# Altium schematic sheet Main.SchDoc: OS-Solar
size A3; CompanyName: Kaasa5; DrawnBy: Nathan Kuchel; Organization: Kaasa5; Address1: 1 Chardonnay Blvd; Address2: Reynella, SA, 5161; Revision: 1.0.0; SheetNumber: 2; SheetTotal: 4; SheetTitle: Main
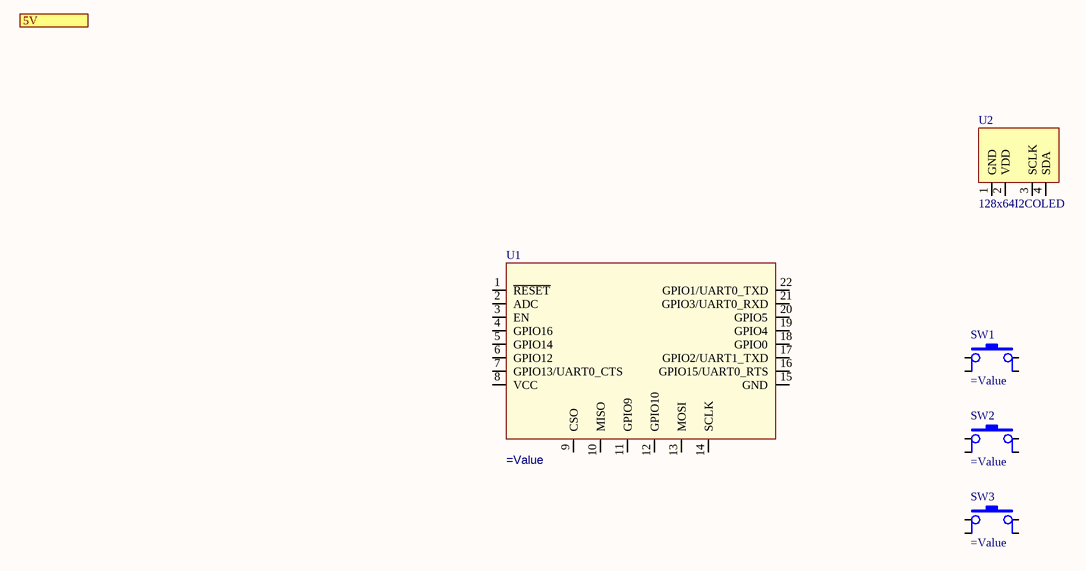
[diagram p0: Main.SchDoc]

## Parts
SW1  (no value)  [SW450P600x600-4N]
SW2  (no value)  [SW450P600x600-4N]
SW3  (no value)  [SW450P600x600-4N]
U1  (no value)  [AITHINKER_ESP12X]
U2  128x64I2COLED  [128x64I2COLED]

## Ports
5V

## Nets

Not connected (* = marked no-connect by the designer): SW1 1 2 3 4; SW2 1 2 3 4; SW3 1 2 3 4; U1 1(~{RESET}) 2(ADC) 3(EN) 4(GPIO16) 5(GPIO14) 6(GPIO12) 7(GPIO13/UART0_CTS) 8(VCC) 9(CSO) 10(MISO) 11(GPIO9) 12(GPIO10) 13(MOSI) 14(SCLK) 15(GND) 16(GPIO15/UART0_RTS) 17(GPIO2/UART1_TXD) 18(GPIO0) 19(GPIO4) 20(GPIO5) 21(GPIO3/UART0_RXD) 22(GPIO1/UART0_TXD); U2 1(GND) 2(VDD) 3(SCLK) 4(SDA)

## Notes on the sheet
- Project:
- Variant:
- Title:
- File:
- Drawn By:
- Print Date:
- Size:
- A3
- Master:
- Approved By:
- Sheet
- Revision
- Date:
- of
- Copyright © 2018 KAASA5

## Library data of the parts
SW1-SW3 = PTS645SK50SMTR92 LFS: SWITCH SMD TACTILE PUSH BUTTON SPST-NO 12V 50mA GULLWING; Manufacturer: C&K Components; PartId: 45; Value: PTS645SK50SMTR92 LFS; Part Number: PTS645SK50SMTR92 LFS; ComponentLink1Description: Datasheet; ComponentLink1URL: https://www.ckswitches.com/products/tactile/PTS645/PTS645SK50SMTR92LFS; Supplier 1: DigiKey; Supplier Part Number 1: CKN9087CT-ND; Price: 0.4; PartStatus: Standard
U1 = ESP-12F: Module SMD WiFi transceiver WiFi n/a; Manufacturer: AITHINKER; PartId: 46; Value: ESP-12F; Part Number: ESP-12F; ComponentLink1Description: Datasheet; ComponentLink1URL: http://wiki.ai-thinker.com/_media/esp8266/a014ps01.pdf; Supplier 1: PCBWAY; Supplier Part Number 1: ESP-12F; Price: 4; PartStatus: Standard
U2 = 128x64I2COLED: Display Module OLED I2C 128x64 OLED I2C 128x64 n/a; Manufacturer: Unknown; PartId: 48; Value: 128x64I2COLED; Part Number: 128x64I2COLED; ComponentLink1Description: Datasheet; ComponentLink1URL: https://www.pcbway.com/project/gifts_detail/I2C_IIC_Serial_128x64_OLED_Display_Module.html; Supplier 1: PCBWAY; Supplier Part Number 1: 128x64I2COLED; Price: 4; PartStatus: Standard